# EasyEDA Pro project ProPrj_RPiPicoSoundBoard_2026-02-23.epro

# Schematic RPiPicoSoundBoard_SG
Board Name: Board1_SG; Create Date: 2026-02-08; Page Name: RPiPicoSoundBoard_SG; Project Name: RPiPicoSoundBoard; Schematic Name: RPiPicoSoundBoard_SG; Update Date: 2026-02-09; Page Size: A4; Version: V1.0
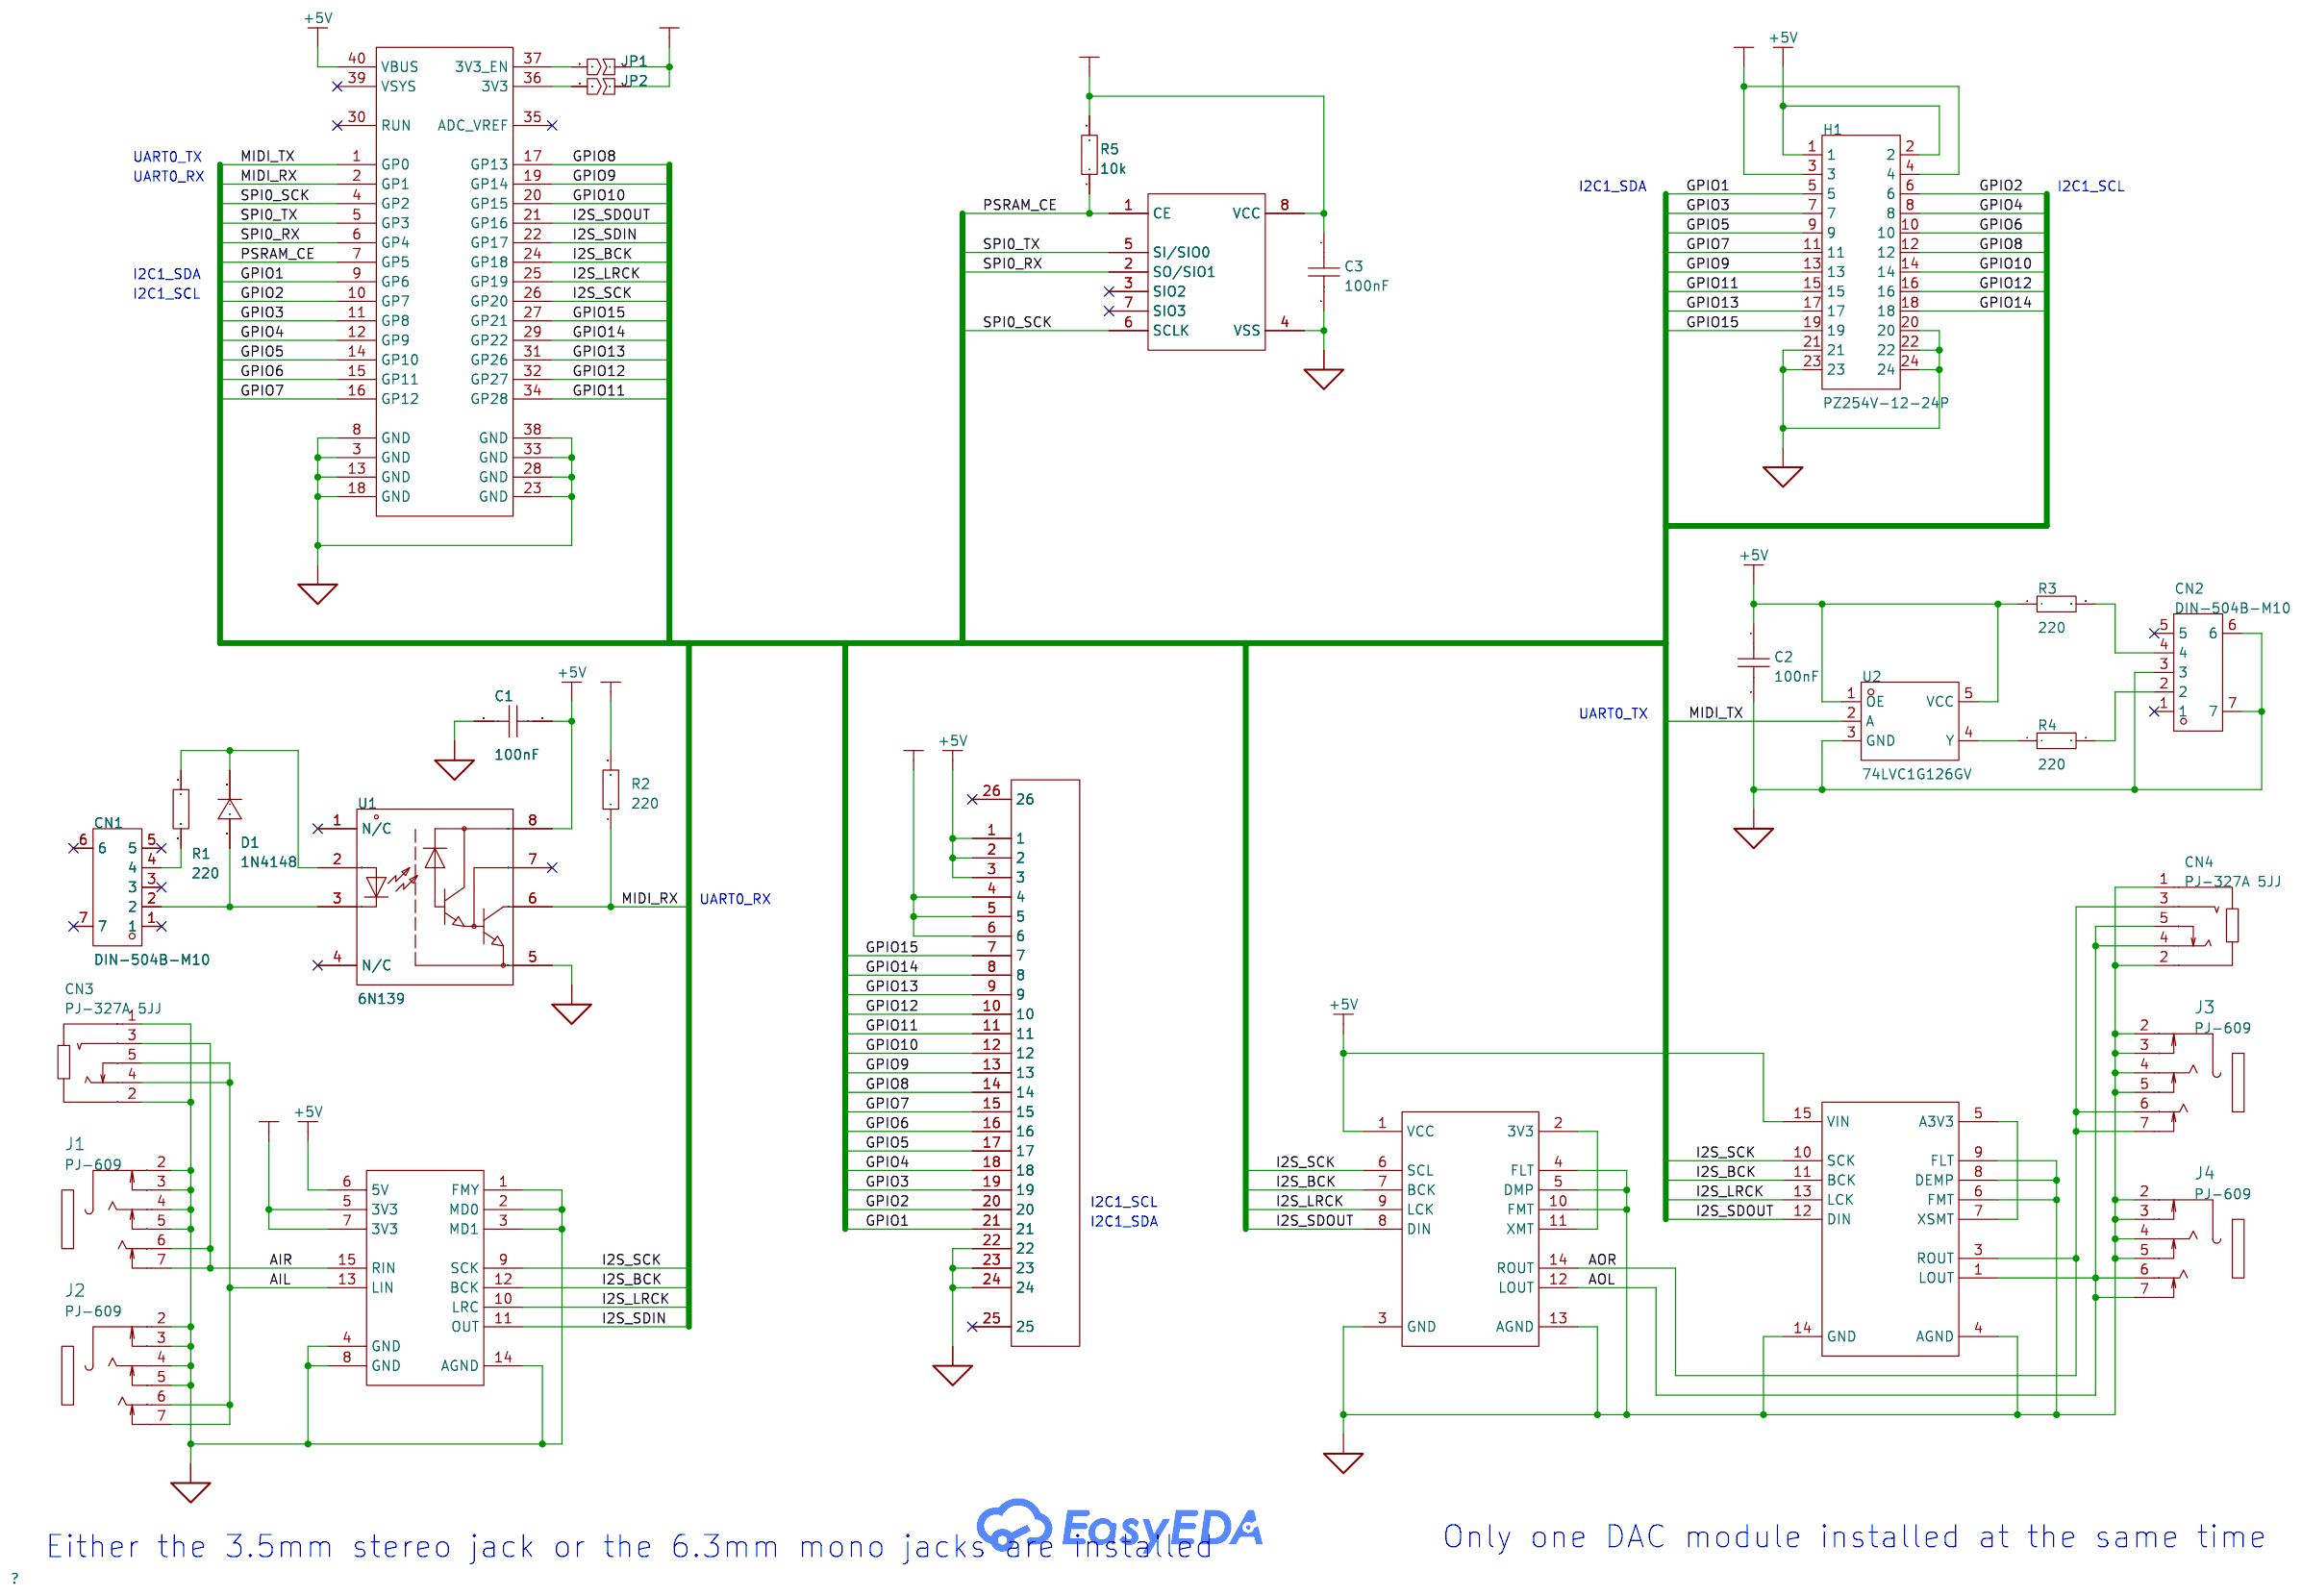
[diagram p0: schematic sheet]

## Parts
C1  100nF  [CAP-TH_L5.5-W2.4-P5.08-D0.6]
C2  100nF  [C0805]
C3  100nF  [C0805]
CN1  DIN-504B-M10  [CONN-TH_DIN-504B-M10]
CN2  DIN-504B-M10  [CONN-TH_DIN-504B-M10]
CN3  PJ-327A 5JJ  [AUDIO-SMD_PJ-327A5JJ]
CN4  PJ-327A 5JJ  [AUDIO-SMD_PJ-327A5JJ]
D1  1N4148  [DO-35_BD2.0-L4.0-P8.00-D0.5-FD]
FPC1  AFC01-S24FCA-00  [FPC-SMD_24P-P0.50_AFC01-S24FCA-00]
H1  PZ254V-12-24P  [HDR-TH_24P-P2.54-V-M-R2-C12-S2.54]
J1  PJ-609  [AUDIO-TH_PJ-609]
J2  PJ-609  [AUDIO-TH_PJ-609]
J3  PJ-609  [AUDIO-TH_PJ-609]
J4  PJ-609  [AUDIO-TH_PJ-609]
JP1  -  [Solder jumper]
JP2  -  [Solder jumper]
M1  Raspberry Pico  [Module_20x2_700mil]
M2  PCM1808  [PCM1808_ADC_MODULE]
M3  PCM5102  [WCMCU-5102]
M4  PCM5102  [PCM5102_MODULE]
R1  10kΩ  [R_AXIAL-0.4]
R2  10kΩ  [R_AXIAL-0.4]
R3  10kΩ  [R0805]
R4  10kΩ  [R0805]
R5  10kΩ  [R0805]
U1  6N139  [DIP-8_L9.6-W6.4-P2.54-LS7.9-BL]
U2  74LVC1G126GV  [SOT-753_L3.1-W1.7-P0.95-LS3.0-BR]
U3  PSRAM 8MB  [SOP-8_L5.3-W5.2-P1.27-LS7.9-BL]

## Library data of the parts
C1 = CC1H104ZC1FD3F5O1100: Capacitance: Tolerance:-20%~+80% Tolerance:-20%~+80% Voltage Rated: Lead Spacing: Temperature Coefficient: φD: Body Thickness:2.4mm; LCSC Part Name: 100nF -20%~+80% 50V; Supplier Part: C2832508; Manufacturer: Dersonic(德尔创); Supplier Footprint: 插件,P=5.08mm; JLCPCB Part Class: Extended Part; Datasheet: https://atta.szlcsc.com/upload/public/pdf/source/20211027/6BE094CC11F3C85D18CFEA066D7024CD.pdf; Supplier: LCSC; Tolerance: -20%~+80%; Body Thickness: 2.4mm
C2 C3 = CAP_0603: Supplier Footprint: 0603
CN1 CN2 = DIN-504B-M10: Supplier Part: C2939346; Manufacturer: HOOYA(皓宇电子); Supplier Footprint: 插件; JLCPCB Part Class: Extended Part; Datasheet: https://atta.szlcsc.com/upload/public/pdf/source/20220120/ABB2570656C6359DBC61E5C1017AC323.pdf; Supplier: LCSC
CN3 CN4 = PJ-327A 5JJ: Connector Type:3.5mm Headphone Jack Current Rating (Max):500mA Voltage Rating (Max):30V Contact Material:Copper Contact Plating:Gold Operating Temperature Range:-30℃~+70℃ Operating Temperature Range:-30℃~+70℃; LCSC Part Name: 3.5mm耳机座; Supplier Part: C668605; Manufacturer: SHOU HAN(首韩); Supplier Footprint: SMD; JLCPCB Part Class: Extended Part; Datasheet: https://atta.szlcsc.com/upload/public/pdf/source/20200618/C668605_9C1065207AFEF8C715B1238987CF5F80.pdf; Supplier: LCSC; Connector Type: 3.5mm Headphone Jack; Current Rating (Max): 500mA; Voltage Rating (Max): 30V; Contact Material: Copper; Contact Plating: Gold; Operating Temperature Range: -30℃~+70℃
D1 = 1N4148_C258182: Diode Configuration:- Voltage - Forward(Vf@If):1V@10mA Voltage - DC Reverse(Vr):100V Current - Rectified:200mA Reverse Leakage Current (Ir):5uA@75V Reverse Recovery Time (trr):4ns Operating Temperature:-55℃~+175℃@(Tj) Operating Temperature:-55℃~+175℃@(Tj); Supplier Part: C258182; Manufacturer: onsemi(安森美); Supplier Footprint: DO-35; JLCPCB Part Class: Extended Part; Datasheet: https://atta.szlcsc.com/upload/public/pdf/source/20180829/C258182_3EE2D0AB6109C1B72B054FC50B8BC8AD.pdf; Supplier: LCSC; Voltage - Forward(Vf@If): 1V@10mA; Voltage - DC Reverse(Vr): 100V; Current - Rectified: 200mA; Reverse Leakage Current (Ir): 5uA@75V; Reverse Recovery Time (trr): 4ns; Operating Temperature: -55℃~+175℃@(Tj)
FPC1 = PC_AFC01-S24FCA-00: Locking Feature:Flip type Contact Type:Bottom Contact Number of Contacts:24P Pitch:0.5mm Mounting Type:Horizontal attachment FFC, FCB Thickness:0.3mm FFC, FCB Thickness:0.3mm Height Above Board:2mm; LCSC Part Name: 间距:0.5mm P数:24P 翻盖式 下接; Supplier Part: C262669; Manufacturer: JS(钜硕电子); Supplier Footprint: SMD,P=0.5mm,卧贴; JLCPCB Part Class: Extended Part; Datasheet: https://atta.szlcsc.com/upload/public/pdf/source/20190816/C413942_2A72D1AC756EAE17EEDF756A339D4500.pdf; Supplier: LCSC; Locking Feature: Flip type; Contact Type: Bottom Contact; Number of Contacts: 24P; Pitch: 0.5mm; Mounting Type: Horizontal attachment; FFC, FCB Thickness: 0.3mm; Height Above Board: 2mm
H1 = PZ254V-12-24P: Pin Structure:2x12P Pitch:2.54mm Row Spacing:2.54mm Circluar Pins/Square Pins:Policy Mounting Type:Straight Number of Rows:Double Row Number of Pins:24P Current Rating:- Voltage Rating (Max):- Length of Mating Pin:6mm Insulation Height:2.5mm Length of End; LCSC Part Name: 2x12P 间距:2.54mm 方针 直插; Supplier Part: C492429; Manufacturer: XFCN(兴飞); Supplier Footprint: 插件,P=2.54mm; JLCPCB Part Class: Extended Part; Datasheet: https://atta.szlcsc.com/upload/public/pdf/source/20200309/C492429_A90DEF30FD4D9CDC2C3DDFC5EAF9C00B.pdf; Supplier: LCSC; Pin Structure: 2x12P; Pitch: 2.54mm; Row Spacing: 2.54mm; Circluar Pins/Square Pins: Policy; Mounting Type: Straight; Number of Rows: Double Row; Number of Pins: 24P; Length of Mating Pin: 6mm; Insulation Height: 2.5mm; Length of End Connection Pin: 3mm; Contact Material: Brass; Operating Temperature: -40℃~+105℃; Color: Black
J1-J4 = PJ-609: Connector Type:6.35mm耳机座 Current Rating (Max):1A Voltage Rating (Max):50V Operating Temperature Range:-20℃~+70℃ Operating Temperature Range:-20℃~+70℃; LCSC Part Name: 6.35mm耳机座 两件套; Supplier Part: C309274; Manufacturer: HOOYA(皓宇电子); Supplier Footprint: 插件; JLCPCB Part Class: Extended Part; Datasheet: https://atta.szlcsc.com/upload/public/pdf/source/20181226/C309274_AB77CFAA40746E22EC2996DC68F300B9.pdf; Supplier: LCSC; Connector Type: 6.35mm耳机座; Current Rating (Max): 1A; Voltage Rating (Max): 50V; Operating Temperature Range: -20℃~+70℃
JP1 JP2 = Solder jumper
M1 = RPI_Pico
M2 = PCM1808_ADC_Module: PCM1808 based ADC audio input module
M3 = WCMCU-5102: A PCM5102 based audio DAC module
M4 = PCM5102_Module: PCM5102 based audio DAC module
R1-R5 = Res_AXIAL-1/8W: Supplier Footprint: Through
U1 = 6N139_C5224104: Forward Voltage:1.4V Output Current:60mA Isolation Voltage(rms):5300V Number of Outputs:1 Operating Temperature:-55℃~+100℃ Operating Temperature:-55℃~+100℃; Supplier Part: C5224104; Manufacturer: VISHAY(威世); Supplier Footprint: DIP-8; JLCPCB Part Class: Extended Part; Datasheet: https://atta.szlcsc.com/upload/public/pdf/source/20221031/1E5B59C0BBF2E24895420015CB89D7D7.pdf; Supplier: LCSC; Forward Voltage: 1.4V; Output Current: 60mA; Isolation Voltage(rms): 5300V; Number of Outputs: 1; Operating Temperature: -55℃~+100℃
U2 = 74LVC1G126GV: Supplier Part: C703586; Manufacturer: Nexperia(安世); Supplier Footprint: SOT-753; JLCPCB Part Class: Extended Part; Datasheet: https://atta.szlcsc.com/upload/public/pdf/source/20200715/C703586_E6345225E39094214D3CD308CDCA878C.pdf; Supplier: LCSC
U3 = ESP_PSRAM64: 8MB of psuedo static random access memory with SPI in 8 pin small outline package

## Nets
3V3: C3.1 FPC1.4 FPC1.5 FPC1.6 H1.3 H1.4 JP1.1 JP2.1 M2.5(3V3) M2.7(3V3) R2.2 R5.2 U3.8(VCC)
+5V: C1.2 C2.1 FPC1.1 FPC1.2 FPC1.3 H1.1 H1.2 M1.40(VBUS) M2.6(5V) M3.1(VCC) M4.15(VIN) R3.1 U1.8(VCC) U2.1(OE) U2.5(VCC)
GND: C1.1 C2.2 C3.2 CN2.3 CN2.6 CN2.7 CN3.1 CN3.2 CN4.1 CN4.2 FPC1.22 FPC1.23 FPC1.24 H1.20 H1.21 H1.22 H1.23 H1.24 J1.2 J1.3 J1.4 J1.5 J2.2 J2.3 J2.4 J2.5 J3.2 J3.3 J3.4 J3.5 J4.2 J4.3 J4.4 J4.5 M1.3(GND) M1.8(GND) M1.13(GND) M1.18(GND) M1.23(GND) M1.28(GND) M1.33(GND) M1.38(GND) M2.1(FMY) M2.2(MD0) M2.3(MD1) M2.4(GND) M2.8(GND) M2.14(AGND) M3.3(GND) M3.4(FLT) M3.5(DMP) M3.10(FMT) M3.13(AGND) M4.4(AGND) M4.6(FMT) M4.8(DEMP) M4.9(FLT) M4.14(GND) U1.5(GND) U2.3(GND) U3.4(VSS)
AIL: CN3.4 CN3.5 J2.6 J2.7 M2.13(LIN)
AIR: CN3.3 J1.6 J1.7 M2.15(RIN)
AOL: CN4.4 CN4.5 J4.6 J4.7 M3.12(LOUT) M4.1(LOUT)
AOR: CN4.3 J3.6 J3.7 M3.14(ROUT) M4.3(ROUT)
GPIO1: FPC1.21 H1.5 M1.9(GP6)
GPIO2: FPC1.20 H1.6 M1.10(GP7)
GPIO3: FPC1.19 H1.7 M1.11(GP8)
GPIO4: FPC1.18 H1.8 M1.12(GP9)
GPIO5: FPC1.17 H1.9 M1.14(GP10)
GPIO6: FPC1.16 H1.10 M1.15(GP11)
GPIO7: FPC1.15 H1.11 M1.16(GP12)
GPIO8: FPC1.14 H1.12 M1.17(GP13)
GPIO9: FPC1.13 H1.13 M1.19(GP14)
GPIO10: FPC1.12 H1.14 M1.20(GP15)
GPIO11: FPC1.11 H1.15 M1.34(GP28)
GPIO12: FPC1.10 H1.16 M1.32(GP27)
GPIO13: FPC1.9 H1.17 M1.31(GP26)
GPIO14: FPC1.8 H1.18 M1.29(GP22)
GPIO15: FPC1.7 H1.19 M1.27(GP21)
I2S_BCK: M1.24(GP18) M2.12(BCK) M3.7(BCK) M4.11(BCK)
I2S_LRCK: M1.25(GP19) M2.10(LRC) M3.9(LCK) M4.13(LCK)
I2S_SCK: M1.26(GP20) M2.9(SCK) M3.6(SCL) M4.10(SCK)
I2S_SDIN: M1.22(GP17) M2.11(OUT)
I2S_SDOUT: M1.21(GP16) M3.8(DIN) M4.12(DIN)
MIDI_RX: M1.2(GP1) R2.1 U1.6(VO)
MIDI_TX: M1.1(GP0) U2.2(A)
PSRAM_CE: M1.7(GP5) R5.1 U3.1(CE)
SPI0_RX: M1.6(GP4) U3.2(SO/SIO1)
SPI0_SCK: M1.4(GP2) U3.6(SCLK)
SPI0_TX: M1.5(GP3) U3.5(SI/SIO0)
$1N8448: D1.2(K) R1.1 U1.2(VF+)
$1N8617: R4.1 U2.4(Y)
$1N9304: CN1.4 R1.2
$1N9313: CN1.2 D1.1(A) U1.3(VF-)
$1N9335: CN2.4 R3.2
$1N9340: CN2.2 R4.2
$1N10058: M3.2(3V3) M3.11(XMT)
$1N10064: M4.5(A3V3) M4.7(XSMT)
$1N32637: JP1.2 M1.37(3V3_EN)
$1N32663: JP2.2 M1.36(3V3)

Not connected (* = marked no-connect by the designer): CN1 1* 3* 5* 6* 7*; CN2 1* 5*; FPC1 25* 26*; M1 30(RUN)* 35(ADC_VREF)* 39(VSYS)*; U1 1(N/C)* 4(N/C)* 7(VB)*; U3 3(SIO2)* 7(SIO3)*

## Notes on the sheet
- UART0_TX
- UART0_RX
- I2C1_SDA
- I2C1_SCL
- I2C1_SDA
- I2C1_SCL
- UART0_TX
- UART0_RX
- I2C1_SCL
- I2C1_SDA
- Either the 3.5mm stereo jack or the 6.3mm mono jacks are installed
- Only one DAC module installed at the same time

# Board RPiPicoSoundBoard_SG
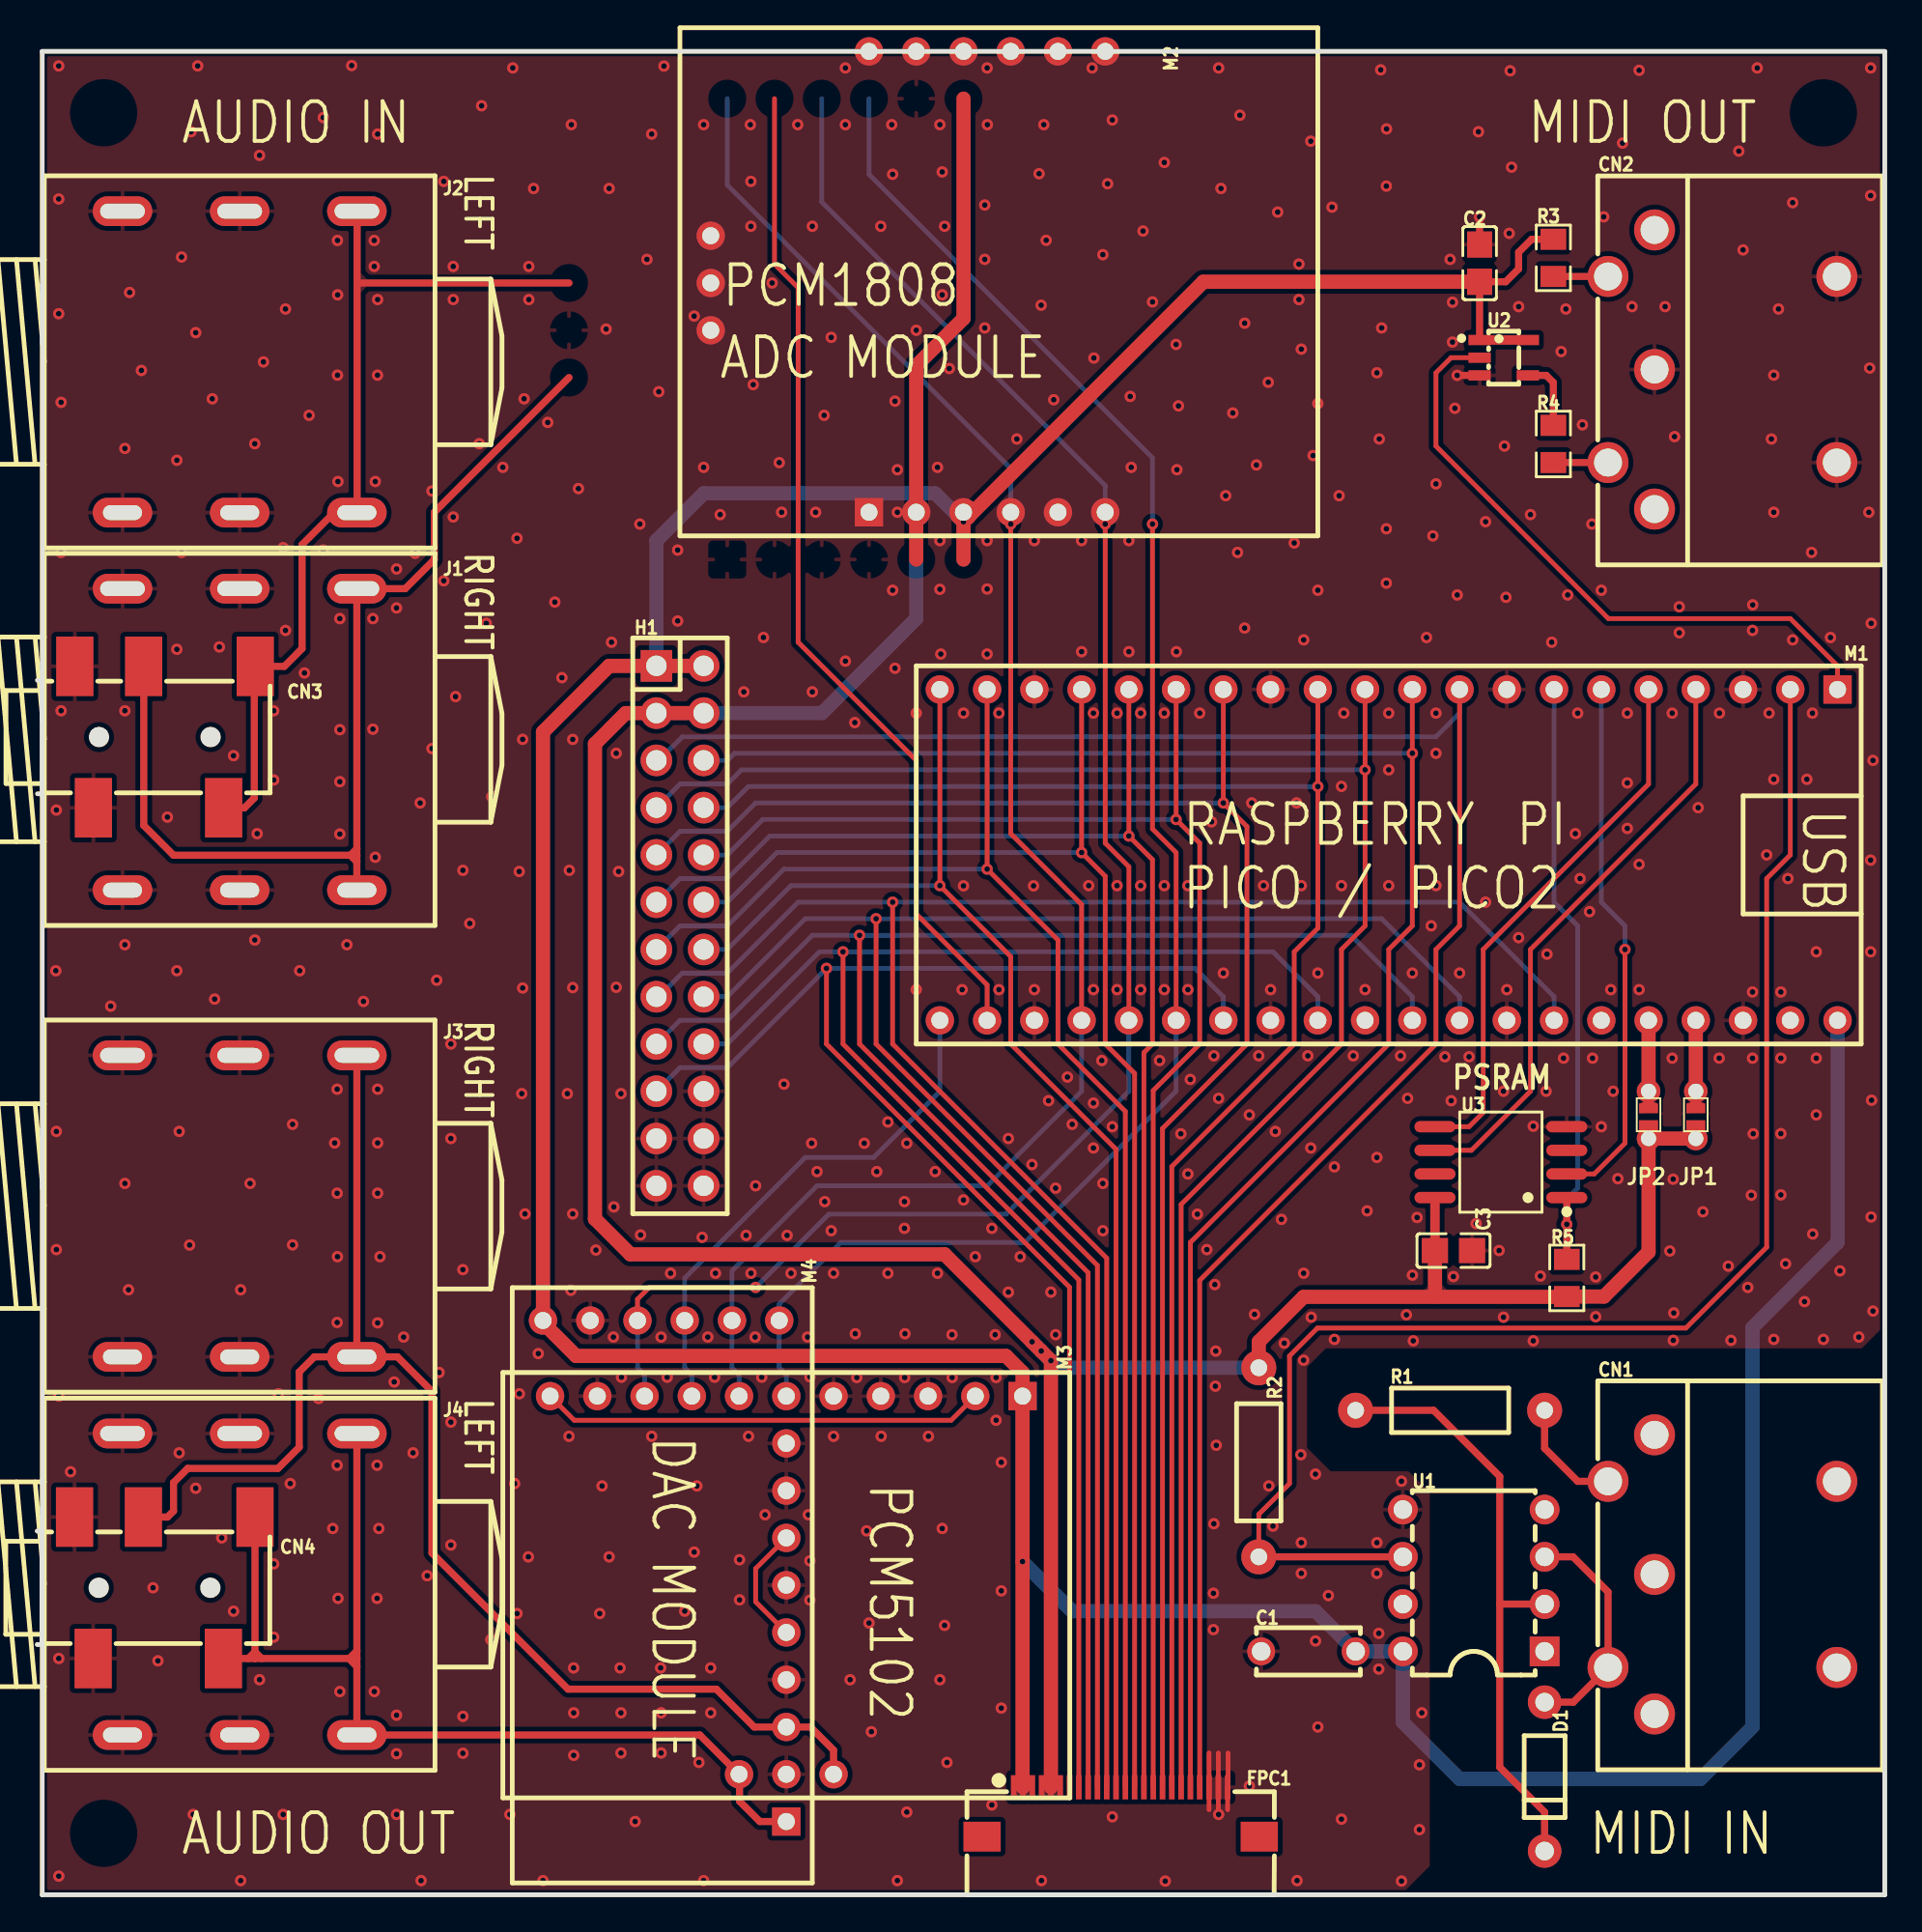
[diagram p1: board, top side]
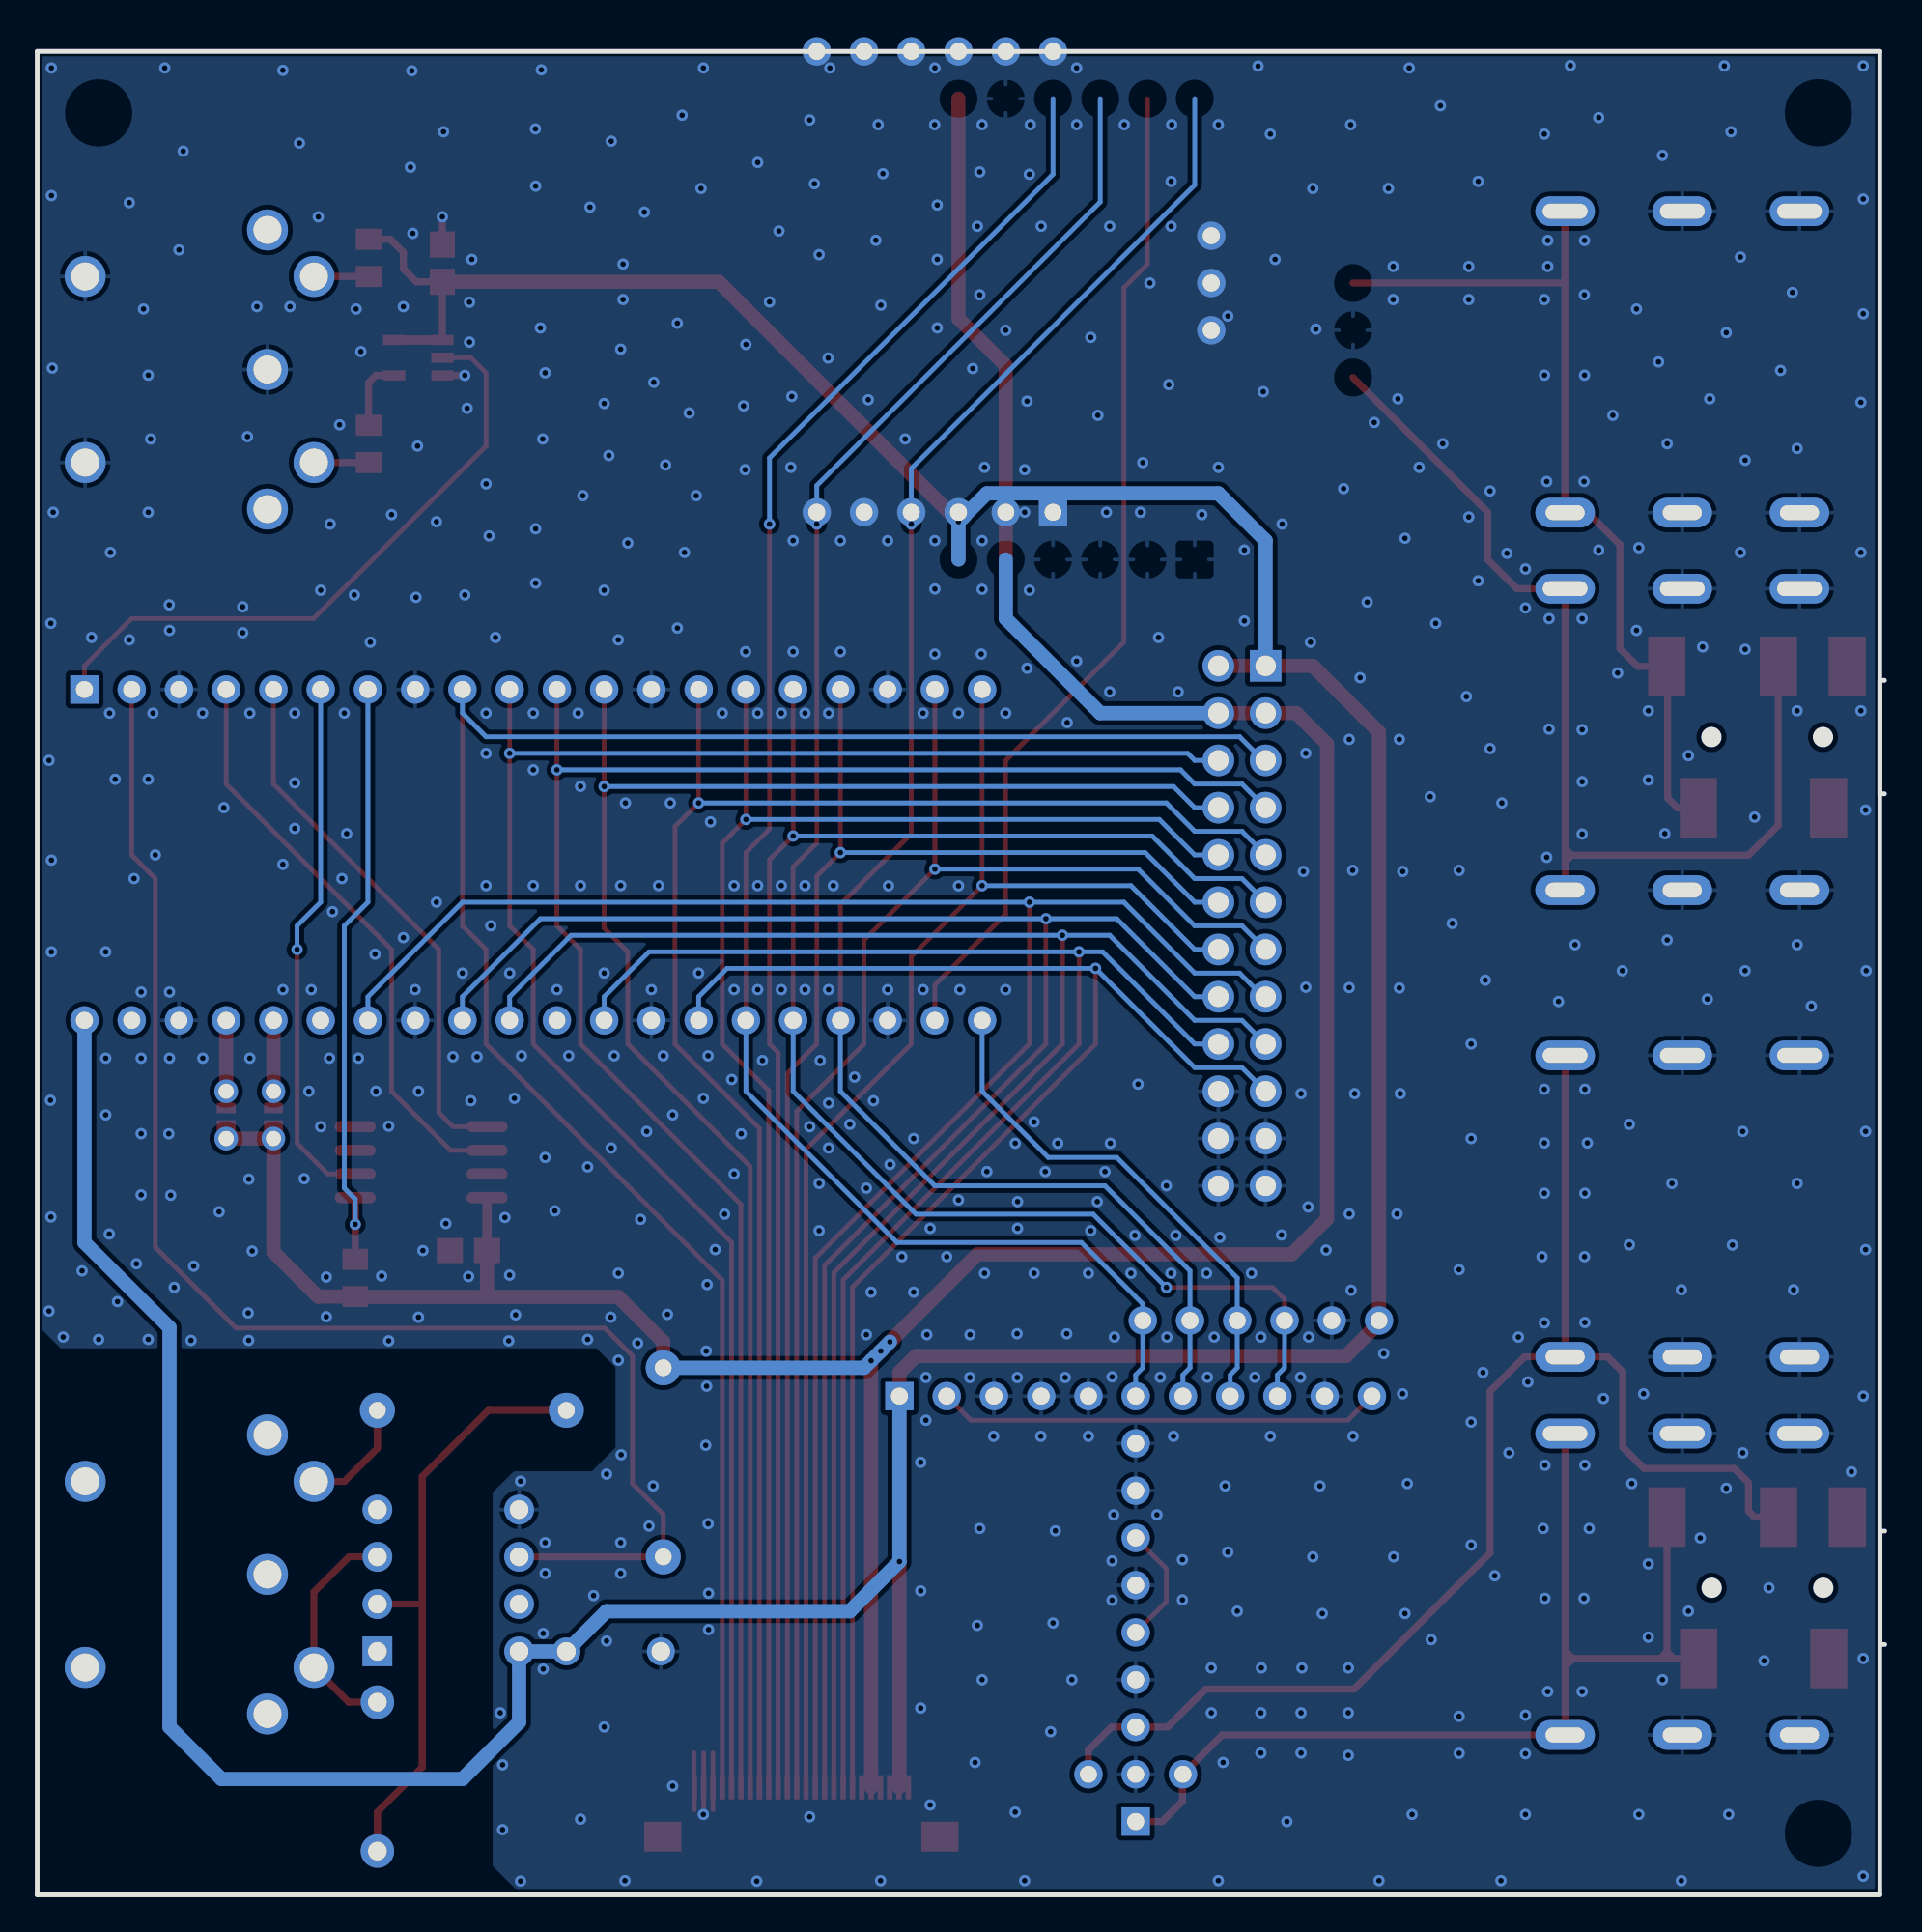
[diagram p2: board, bottom side, seen from below]

Outline 99.33 x 99.06 mm; copper layers: Top Layer, Bottom Layer. Coordinates in mm from the lower left corner of the outline.
Outline path: 0.27,99.06 99.33,99.06 99.33,0 0.27,0 0.27,99.06
Stack: Top Layer 0.035mm / Dielectric1 1.51mm FR4 er 4.5 / Bottom Layer 0.035mm

## Design rules (mm)
template: Custom Config
spacing copperThickness1oz (default): track to track 0.152, other pairs 0.152 to 0.3
spacing copperThickness2oz: track to track 0.203, other pairs 0.152 to 0.3
track width copperThickness1oz (default): min 0.127, default 0.254, max 2.54
track width copperThickness2oz: min 0.203, default 0.254, max 2.54
differential pair differentialPair (default): width min 0.127, default 0.254, max 2.54; gap min 0.152, default 0.152
via viaSize (default): diameter min 0.5, default 0.61, max 10; hole min 0.3, default 0.305, max 6.3

## Placement (name value [footprint] x y rotation side)
C1  100nF  [CAP-TH_L5.5-W2.4-P5.08-D0.6]  68.34 13.08 0 top
C2  100nF  [C0805]  77.54 87.68 90 top
C3  100nF  [C0805]  76.14 34.62 0 top
CN1  DIN-504B-M10  [CONN-TH_DIN-504B-M10]  90.6 17.22 90 top
CN2  DIN-504B-M10  [CONN-TH_DIN-504B-M10]  90.6 81.97 90 top
CN3  PJ-327A 5JJ  [AUDIO-SMD_PJ-327A5JJ]  6.87 62.22 90 top
CN4  PJ-327A 5JJ  [AUDIO-SMD_PJ-327A5JJ]  6.86 16.5 90 top
D1  1N4148  [DO-35_BD2.0-L4.0-P8.00-D0.5-FD]  81.04 6.35 270 top
FPC1  AFC01-S24FCA-00  [FPC-SMD_24P-P0.50_AFC01-S24FCA-00]  58.25 4.45 0 top
H1  PZ254V-12-24P  [HDR-TH_24P-P2.54-V-M-R2-C12-S2.54]  34.56 52.07 270 top
J1  PJ-609  [AUDIO-TH_PJ-609]  10.89 62.09 0 top
J2  PJ-609  [AUDIO-TH_PJ-609]  10.89 82.37 0 top
J3  PJ-609  [AUDIO-TH_PJ-609]  10.89 37.01 0 top
J4  PJ-609  [AUDIO-TH_PJ-609]  10.89 16.69 0 top
JP1  -  [Solder jumper]  89.17 41.37 90 top
JP2  -  [Solder jumper]  86.63 41.37 90 top
M1  Raspberry Pico  [Module_20x2_700mil]  96.79 64.77 270 top
M2  PCM1808  [PCM1808_ADC_MODULE]  37.1 71.75 90 top
M3  PCM5102  [WCMCU-5102]  52.97 26.8 270 top
M4  PCM5102  [PCM5102_MODULE]  40.27 3.94 180 top
NOREF  -  [Pad_e185]  86.63 43.18 0 top
NOREF#2  -  [Pad_e188]  86.63 40.64 0 top
NOREF#3  -  [Pad_e189]  89.17 40.64 0 top
NOREF#4  -  [Pad_e187]  89.17 43.18 0 top
R1  10kΩ  [R_AXIAL-0.4]  75.96 26.03 0 top
R2  10kΩ  [R_AXIAL-0.4]  65.67 23.24 90 top
R3  10kΩ  [R0805]  81.51 87.96 270 top
R4  10kΩ  [R0805]  81.51 77.96 270 top
R5  10kΩ  [R0805]  82.23 33.15 270 top
U1  6N139  [DIP-8_L9.6-W6.4-P2.54-LS7.9-BL]  77.23 16.89 90 top
U2  74LVC1G126GV  [SOT-753_L3.1-W1.7-P0.95-LS3.0-BR]  78.84 82.6 180 top
U3  PSRAM 8MB  [SOP-8_L5.3-W5.2-P1.27-LS7.9-BL]  78.69 39.37 90 top

## Footprints (pads in the part's own frame, mm; a bottom-side part is the same pattern mirrored in y, then rotated)
AUDIO-SMD_PJ-327A5JJ
  rect 3.2x2 smd: 1(3.8,4.85) 2(-3.8,3.85) 3(3.8,1.15) 4(-3.8,-3.15) 5(3.8,-4.85)
AUDIO-TH_PJ-609
  oval 3.2x1.6 hole 2.1x0.8: 2(-6.3,-8.1) 4(0,-8.1) 6(6.3,-8.1)
  oval 3.2x1.6 hole 2.4x0.8: 3(-6.3,8.1) 5(0,8.1) 7(6.3,8.1)
C0805
  rect 1.41x1.35 smd: 1(-1,0) 2(1,0)
CAP-TH_L5.5-W2.4-P5.08-D0.6
  round 1.5 hole 1: 1(-2.54,0) 2(2.54,0)
CONN-TH_DIN-504B-M10
  round 2.2 hole 1.5: 1(-7.5,3.65) 2(-5,6.15) 3(0,3.65) 4(5,6.15) 5(7.5,3.65) 6(-5,-6.15) 7(5,-6.15)
DIP-8_L9.6-W6.4-P2.54-LS7.9-BL
  rect 1.6x1.6 hole 1: 1(-3.81,-3.81)
  round 1.6 hole 1: 2(-1.27,-3.81) 3(1.27,-3.81) 4(3.81,-3.81) 5(3.81,3.81) 6(1.27,3.81) 7(-1.27,3.81) 8(-3.81,3.81)
DO-35_BD2.0-L4.0-P8.00-D0.5-FD
  round 1.8 hole 1: 1(-4,0) 2(4,0)
FPC-SMD_24P-P0.50_AFC01-S24FCA-00
  rect 0.3x1.3 smd: 1(-5.75,1.325) 2(-5.25,1.325) 3(-4.75,1.325) 4(-4.25,1.325) 5(-3.75,1.325) 6(-3.25,1.325) 7(-2.75,1.325) 8(-2.25,1.325) 9(-1.75,1.325) 10(-1.25,1.325) 11(-0.75,1.325) 12(-0.25,1.325) 13(0.25,1.325) 14(0.75,1.325) 15(1.25,1.325) 16(1.75,1.325) 17(2.25,1.325) 18(2.75,1.325) 19(3.25,1.325) 20(3.75,1.325) 21(4.25,1.325) 22(4.75,1.325) 23(5.25,1.325) 24(5.75,1.325)
  rect 2x1.6 smd: 25(7.45,-1.325) 26(-7.45,-1.325)
HDR-TH_24P-P2.54-V-M-R2-C12-S2.54
  rect 1.7x1.7 hole 1.1: 1(-13.97,-1.27)
  round 1.7 hole 1.1: 2(-13.97,1.27) 3(-11.43,-1.27) 4(-11.43,1.27) 5(-8.89,-1.27) 6(-8.89,1.27) 7(-6.35,-1.27) 8(-6.35,1.27) 9(-3.81,-1.27) 10(-3.81,1.27) 11(-1.27,-1.27) 12(-1.27,1.27) 13(1.27,-1.27) 14(1.27,1.27) 15(3.81,-1.27) 16(3.81,1.27) 17(6.35,-1.27) 18(6.35,1.27) 19(8.89,-1.27) 20(8.89,1.27) 21(11.43,-1.27) 22(11.43,1.27) 23(13.97,-1.27) 24(13.97,1.27)
Module_20x2_700mil
  rect 1.524x1.524 hole 0.914: 1(0,0)
  round 1.524 hole 0.914: 2(0,-2.54) 3(0,-5.08) 4(0,-7.62) 5(0,-10.16) 6(0,-12.7) 7(0,-15.24) 8(0,-17.78) 9(0,-20.32) 10(0,-22.86) 11(0,-25.4) 12(0,-27.94) 13(0,-30.48) 14(0,-33.02) 15(0,-35.56) 16(0,-38.1) 17(0,-40.64) 18(0,-43.18) 19(0,-45.72) 20(0,-48.26) 21(17.78,-48.26) 22(17.78,-45.72) 23(17.78,-43.18) 24(17.78,-40.64) 25(17.78,-38.1) 26(17.78,-35.56) 27(17.78,-33.02) 28(17.78,-30.48) 29(17.78,-27.94) 30(17.78,-25.4) 31(17.78,-22.86) 32(17.78,-20.32) 33(17.78,-17.78) 34(17.78,-15.24) 35(17.78,-12.7) 36(17.78,-10.16) 37(17.78,-7.62) 38(17.78,-5.08) 39(17.78,-2.54) 40(17.78,0)
Pad_e185
  round 1.27 hole 0.813: 1(0,0)
Pad_e187
  round 1.27 hole 0.813: 1(0,0)
Pad_e188
  round 1.27 hole 0.813: 1(0,0)
Pad_e189
  round 1.27 hole 0.813: 1(0,0)
PCM1808_ADC_MODULE
  rect 1.524x1.524 hole 0.914: 1(2.54,-7.62)
  round 1.524 hole 0.914: 2(2.54,-10.16) 3(2.54,-12.7) 4(2.54,-15.24) 5(2.54,-17.78) 6(2.54,-20.32) 7(27.305,-20.32) 8(27.305,-17.78) 9(27.305,-15.24) 10(27.305,-12.7) 11(27.305,-10.16) 12(27.305,-7.62) 13(17.399,0.889) 14(14.859,0.889) 15(12.319,0.889)
PCM5102_MODULE
  rect 1.524x1.524 hole 0.914: 1(0,0)
  round 1.524 hole 0.914: 3(0,-5.08) 4(0,-7.62) 5(0,-10.16) 6(0,-12.7) 7(0,-15.24) 8(0,-17.78) 9(0,-20.32) 10(0.381,-26.924) 11(2.921,-26.924) 12(5.461,-26.924) 13(8.001,-26.924) 14(10.541,-26.924) 15(13.081,-26.924)
R0805
  rect 1.133x1.377 smd: 1(-1,0) 2(1,0)
R_AXIAL-0.4
  round 1.879 hole 0.899: 1(-5.08,0) 2(5.08,0)
Solder jumper
  custom 0.635x1.016 smd: 1(0.021,0)
  custom 0.692x1.016 smd: 2(0.973,0)
SOP-8_L5.3-W5.2-P1.27-LS7.9-BL
  oval 0.609x2.204 smd: 1(-1.905,-3.542) 2(-0.635,-3.542) 3(0.635,-3.542) 4(1.905,-3.542) 5(1.905,3.542) 6(0.635,3.542) 7(-0.635,3.542) 8(-1.905,3.542)
SOT-753_L3.1-W1.7-P0.95-LS3.0-BR
  rect 1.199x0.551 smd: 1(1.296,-0.95) 2(1.296,0) 3(1.296,0.95) 4(-1.296,0.95) 5(-1.296,-0.95)
WCMCU-5102
  rect 1.524x1.524 hole 0.914: 1(0,0)
  round 1.524 hole 0.914: 2(0,-2.54) 3(0,-5.08) 4(0,-7.62) 5(0,-10.16) 6(0,-12.7) 7(0,-15.24) 8(0,-17.78) 9(0,-20.32) 10(0,-22.86) 11(0,-25.4) 12(20.32,-15.24) 13(20.32,-12.7) 14(20.32,-10.16)

## Nets
As in the schematic, except:
3V3: C3.1 FPC1.4 FPC1.5 FPC1.6 H1.3 H1.4 JP1.1 JP2.1 M2.5 M2.7 NOREF#2.1 NOREF#3.1 R2.2 R5.2 U3.8
$1N32637: JP1.2 M1.37 NOREF#4.1
$1N32663: JP2.2 M1.36 NOREF.1

Pads without a net: CN1 1 3 5 6 7; CN2 1 5; FPC1 25 26; M1 30 35 39; U1 1 4 7; U3 3 7

## Via types
v1: diameter 0.61, hole 0.305, Top Layer to Bottom Layer, 663 vias

## Routing (per net, layer and track width the routed paths; a pad name or vN(x,y) marks a point on that pad's centre or on a via; arc(x,y) is an arc through that point)
3V3: length 176.2
  Top Layer w0.508: C3.1 75.15,34.62 U3.8
  Top Layer w0.762: 47.26,71.75 47.26,82.17 49.8,84.71 49.8,96.52 ; 75.15,32.16 75.15,34.62 C3.1 ; 54.5,5.78 v1(54.5,28.7) v1(53.98,29.22) v1(53.48,29.72) 48.78,34.42 31.89,34.42 29.99,36.32 29.99,61.85 31.64,63.5 H1.3 H1.4 ; 65.67,28.32 65.67,29.72 68.09,32.13 82.21,32.13 R5.2 84.23,32.15 86.63,34.54 NOREF#2.1 NOREF#3.1
  Bottom Layer w0.762: H1.4 42.18,63.5 47.26,68.58 47.26,71.75 ; 65.67,28.32 54.88,28.32 v1(54.5,28.7) v1(53.98,29.22) 53.48,29.72
+5V: length 260.5
  Top Layer w0.381: R3.1 80.34,88.96 79.64,88.27 79.64,87.38 78.95,86.68 C2.1 77.54,83.55
  Top Layer w0.508: U2.1 U2.5
  Top Layer w0.762: H1.2 H1.1 30.75,66.04 27.19,62.48 27.19,30.73 28.97,28.96 52.08,28.96 52.97,28.07 M3.1 v1(52.97,17.91) 52.97,5.8 FPC1.2 ; C2.1 62.69,86.68 v1(49.8,73.79) 49.8,71.75
  Bottom Layer w0.762: 49.8,71.76 49.8,73.79 48.27,75.31 35.83,75.31 33.29,72.77 H1.1 ; M3.1 v1(52.97,17.91) 55.64,15.24 68.72,15.24 C1.2 U1.8 73.42,9.27 76.47,6.22 89.42,6.22 92.22,9.02 92.22,30.48 96.79,35.05 M1.40
GND: length 11.8
  Top Layer w0.254: 63.5,7.62 FPC1.23 63.5,4.59 ; 63,7.62 FPC1.22 63,4.57 ; 64,4.57 FPC1.24 64.02,5.8 64.02,7.62
  Top Layer w0.381: C2.2 v1(77.54,90.17) ; U2.3 v1(76.34,81.65)
  vias: v1(1,49.66) v1(1.03,58.29) v1(1.03,41.02) v1(1.03,34.67) v1(1.16,98.28) v1(1.16,91.13) v1(1.16,84.96) v1(1.16,26.8) v1(1.16,12.7) v1(1.16,1) v1(1.28,80.2) v1(1.28,72.14) v1(1.28,63.63) v1(1.79,22.73) v1(3.95,47.75) v1(4.71,77.72) v1(4.71,63.63) v1(4.71,51.05) v1(4.71,38.23) v1(4.91,32.51) v1(4.97,86.11) v1(5.6,81.92) v1(6.23,16.5) v1(6.49,12.57) v1(7,57.91) v1(7.51,77.09) v1(7.51,66.93) v1(7.51,49.66) v1(7.63,41.02) v1(7.63,23.75) v1(7.76,88.01) v1(7.76,72.14) v1(8.19,34.92) v1(8.27,94.74) v1(8.39,4.32) v1(8.52,83.95) v1(8.52,21.84) v1(8.63,98.28) v1(9.41,80.39) v1(9.54,48.13) v1(9.79,67.06) v1(9.92,19.18) v1(10.56,61.21) v1(10.56,15.24) v1(10.94,32.51) v1(10.94,0.76) v1(11.44,38.23) v1(11.7,77.98) v1(11.7,51.31) v1(11.83,57.02) v1(11.95,93.47) v1(11.95,11.56) v1(12.16,82.37) v1(12.71,63.63) v1(12.71,59.91) v1(12.71,17.78) v1(12.71,13.84) v1(12.97,26.92) v1(13.22,72.39) v1(13.22,4.32) v1(13.35,85.22) v1(13.35,67.95) v1(13.6,22.1) v1(13.73,41.4) v1(13.73,34.92) v1(14.11,49.66) v1(14.36,65.66) v1(14.62,79.5) v1(15.13,26.67) v1(15.38,95.5) v1(15.38,72.26) v1(15.89,19.69) v1(15.99,40.4) v1(16.14,88.9) v1(16.15,85.98) v1(16.14,81.66) v1(16.17,75.95) v1(16.12,43.29) v1(16.12,37.7) v1(16.14,34.29) v1(16.12,30.75) v1(16.12,23.08) v1(16.17,15.93) v1(16.27,68.58) v1(16.27,62.61) v1(16.27,59.82) v1(16.27,57) v1(16.27,10.92) v1(16.65,51.05) v1(16.91,98.3) v1(17.54,48.01) v1(18.05,68.58) v1(18.05,62.64) v1(18.12,88.9) v1(18.12,87.5) v1(18.17,75.95) v1(18.17,55.75) v1(18.12,10.92) v1(18.3,94.62) v1(18.3,85.73) v1(18.3,81.66) v1(18.3,43.29) v1(18.3,40.4) v1(18.3,37.7) v1(18.3,30.73) v1(18.27,23.08) v1(18.27,15.93) v1(18.37,19.69) v1(18.43,34.29) v1(19.19,27.56) v1(19.32,71.25) v1(19.32,69.15) v1(19.32,9.65) v1(19.32,7.58) v1(19.32,4.32) v1(19.7,29.97) v1(20.21,23.75) v1(20.32,72.09) v1(20.59,58.67) v1(20.64,0.76) v1(20.97,17.15) v1(21.22,75.44) v1(21.22,61.59) v1(21.48,49.15) v1(21.6,28.07) v1(21.86,92.08) v1(21.86,70.61) v1(22.24,45.72) v1(22.24,40.64) v1(22.24,25.4) v1(22.24,18.8) v1(22.37,87.5) v1(22.37,85.73) v1(22.37,74.04) v1(22.49,64.39) v1(22.89,55.05) v1(22.89,33.59) v1(22.89,9.59) v1(22.89,7.6) v1(23.25,52.2) v1(23.76,77.98) v1(23.89,96.14) v1(24.14,68.33) v1(24.39,13.71) v1(24.44,59.01) v1(25.03,76.71) v1(25.41,4.32) v1(25.57,98.17) v1(25.67,22.1) v1(25.8,72.9) v1(25.8,15.11) v1(25.91,54.99) v1(25.92,26.92) v1(26.1,62.09) v1(26.1,48.73) v1(26.05,43.05) v1(26.18,80.39) v1(26.22,36.59) v1(26.4,18.16) v1(26.43,87.5) v1(26.43,85.73) v1(26.68,91.69) v1(26.94,29.08) v1(27.19,0.76) v1(27.45,79.12) v1(27.83,69.47) v1(28.21,65.41) v1(28.5,43.05) v1(28.61,55.05) v1(28.59,24.64) v1(28.72,95.12) v1(28.69,32.49) v1(28.79,62.09) v1(28.79,48.75) v1(28.79,36.59) v1(28.84,12.19) v1(28.84,9.78) v1(28.84,7.49) v1(29.1,75.56) v1(30.04,34.65) v1(30.24,15.11) v1(30.37,21.97) v1(30.59,84.14) v1(30.75,91.69) v1(30.75,18.16) v1(30.88,67.31) v1(31,36.97) v1(30.98,29.97) v1(31.13,61.34) v1(31.13,48.77) v1(31.26,54.99) v1(31.38,43.05) v1(31.41,27.81) v1(31.34,12.19) v1(31.38,9.78) v1(31.38,7.62) v1(32.15,3.94) v1(32.4,73.66) v1(32.44,35.46) v1(32.78,87.88) v1(33.03,94.62) v1(33.03,24.64) v1(33.41,80.77) v1(33.52,12.19) v1(33.54,29.97) v1(33.54,9.78) v1(33.54,7.62) v1(33.69,98.27) v1(33.87,27.81) v1(34.05,33.4) v1(34.43,72.26) v1(34.43,68.45) v1(34.81,15.24) v1(35.32,84.84) v1(35.32,18.41) v1(35.47,21.97) v1(35.57,7.11) v1(35.75,35.33) v1(35.83,95.12) v1(35.83,76.71) v1(35.83,0.76) v1(36.05,29.97) v1(36.21,12.19) v1(36.21,9.78) v1(36.42,27.81) v1(36.46,33.4) v1(36.72,74.17) v1(37.76,18.01) v1(37.76,15.85) v1(37.99,64.64) v1(38.11,35.43) v1(38.24,24.64) v1(38.34,95.12) v1(38.37,92.08) v1(38.37,89.66) v1(38.38,33.4) v1(38.5,81.15) v1(38.6,29.97) v1(38.62,38.1) v1(38.95,27.81) v1(39.04,67.56) v1(39.13,20.42) v1(39.51,86.61) v1(39.89,76.96) v1(40.02,74.3) v1(40.15,43.56) v1(40.31,35.43) v1(40.53,33.4) v1(40.89,95.12) v1(41.42,29.97) v1(41.46,20.42) v1(41.54,27.83) v1(41.54,17.95) v1(41.54,15.83) v1(41.67,89.66) v1(41.67,64.64) v1(41.63,40.39) v1(41.85,74.3) v1(41.92,38.86) v1(42.31,79.5) v1(42.34,37.25) v1(42.69,83.69) v1(42.69,35.69) v1(42.81,33.4) v1(42.81,24.64) v1(43.45,98.17) v1(43.45,95.12) v1(43.45,66.29) v1(43.7,11.56) v1(43.96,62.99) v1(43.98,30.15) v1(44.06,27.8) v1(44.46,40.39) v1(44.59,19.56) v1(44.72,14.6) v1(44.84,8.76) v1(45.13,38.86) v1(45.35,89.66) v1(45.37,24.64) v1(45.73,41.53) v1(45.73,33.4) v1(45.94,95.12) v1(45.99,92.46) v1(45.99,70.1) v1(46.12,80.26) v1(46.12,65.91) v1(46.24,76.58) v1(46.24,74.3) v1(46.24,0.76) v1(46.62,37.25) v1(46.62,35.81) v1(46.65,30.15) v1(46.64,27.8) v1(46.75,40.39) v1(46.75,4.44) v1(47.26,84.07) v1(47.26,63.5) v1(47.26,48.64) v1(47.91,24.64) v1(48.27,38.86) v1(48.4,76.71) v1(48.4,33.4) v1(48.53,95.12) v1(48.53,72.77) v1(48.53,70.15) v1(48.58,66.67) v1(48.53,11.56) v1(48.66,92.58) v1(48.66,85.98) v1(48.66,19.69) v1(48.78,89.66) v1(48.78,14.48) v1(48.91,7.11) v1(49.04,82.02) v1(49.18,30.1) v1(49.19,27.8) v1(49.8,63.5) v1(49.8,54.22) v1(49.72,48.64) v1(49.8,37.34) v1(50.43,34.29) v1(50.94,90.81) v1(50.94,87.88) v1(50.94,84.2) v1(51.07,98.17) v1(51.08,95.12) v1(51.07,72.77) v1(51.07,70.17) v1(51.07,66.67) v1(51.32,35.81) v1(51.32,4.83) v1(51.5,30.1) v1(51.55,27.8) v1(51.55,25.5) v1(51.7,63.5) v1(51.7,48.64) v1(51.83,23.24) v1(51.83,16.33) v1(51.83,10.03) v1(52.21,40.64) v1(52.21,32.39) v1(52.67,78.23) v1(52.85,34.29) v1(53.48,39.24) v1(53.61,72.77) v1(53.56,54.22) v1(53.61,48.64) v1(53.86,92.49) v1(53.97,85.42) v1(53.99,0.76) v1(54.12,95.12) v1(54.24,88.91) v1(54.37,42.67) v1(54.5,32.39) v1(54.65,80.34) v1(54.75,37.97) v1(54.75,30.1) v1(55.39,43.94) v1(55.64,41.4) v1(56.15,72.77) v1(56.15,66.8) v1(56.53,54.23) v1(56.71,98.17) v1(56.81,82.58) v1(56.78,63.5) v1(56.78,48.64) v1(56.78,42.55) v1(56.78,40.13) v1(57.29,88.14) v1(57.23,44.83) v1(57.29,38.23) v1(57.29,35.69) v1(57.54,91.95) v1(57.8,95.38) v1(57.8,41.28) v1(57.8,4.19) v1(58.05,63.5) v1(58.05,54.23) v1(58.05,48.64) v1(58.69,72.77) v1(58.69,66.8) v1(58.76,80.52) v1(58.81,76.71) v1(59.32,63.5) v1(59.32,54.23) v1(59.32,48.64) v1(59.45,89.41) v1(59.96,85.6) v1(60.34,44.83) v1(60.59,93.09) v1(60.59,63.5) v1(60.59,54.23) v1(60.59,48.64) v1(60.64,0.74) v1(61.23,83.31) v1(61.27,76.58) v1(61.25,66.8) v1(61.35,80.01) v1(61.48,40.89) v1(61.86,54.23) v1(61.86,48.64) v1(61.86,38.73) v1(61.99,43.81) v1(62.37,36.58) v1(62.5,63.5) v1(62.88,34.67) v1(63.13,57.66) v1(63.26,45.09) v1(63.31,32.79) v1(63.26,19.94) v1(63.23,16.21) v1(63.23,14.25) v1(63.36,29.22) v1(63.34,27.33) v1(63.39,24.16) v1(63.51,98.17) v1(63.51,42.8) v1(63.51,4.32) v1(63.64,91.69) v1(63.77,49.53) v1(63.9,75.18) v1(64.28,79.63) v1(64.53,72.14) v1(64.66,95.63) v1(64.92,84.45) v1(64.91,68.07) v1(65.16,41.91) v1(65.16,5.84) v1(65.29,58.67) v1(65.44,31.19) v1(65.55,76.84) v1(65.67,45.09) v1(65.93,54.23) v1(66.18,81.28) v1(66.21,21.97) v1(66.31,48.64) v1(66.44,19.81) v1(66.56,41.02) v1(66.69,90.42) v1(66.89,36.3) v1(67.04,29.64) v1(67.58,72.64) v1(67.71,58.67) v1(67.73,0.76) v1(67.83,87.63) v1(67.83,85.73) v1(67.96,83.06) v1(67.96,54.23) v1(67.94,23.65) v1(67.96,18.92) v1(67.96,17.27) v1(68.09,67.44) v1(68.09,33.4) v1(68.08,28.73) v1(68.31,45.09) v1(68.47,94.23) v1(68.47,40.13) v1(68.49,31.04) v1(68.59,77.34) v1(68.72,22.61) v1(68.72,13.64) v1(68.85,80.14) v1(68.85,70.1) v1(68.85,49.53) v1(68.85,9.02) v1(69.42,16.08) v1(69.61,90.69) v1(69.74,39.12) v1(69.74,29.84) v1(69.99,75.18) v1(70.12,59.56) v1(70.12,54.23) v1(70.12,4.06) v1(70.25,63.5) v1(70.75,45.09) v1(71.39,48.64) v1(71.5,36.75) v1(72.02,81.79) v1(72.02,39.62) v1(72.02,18.92) v1(72.02,17.27) v1(72.15,78.23) v1(72.12,14.05) v1(72.12,12.13) v1(72.23,98.07) v1(72.28,84.2) v1(72.54,94.9) v1(72.53,91.82) v1(72.53,73.41) v1(72.53,70.48) v1(72.66,63.5) v1(72.66,60.45) v1(72.66,54.23) v1(73.29,45.09) v1(73.34,22.22) v1(73.34,0.74) v1(73.61,31.17) v1(73.67,42.8) v1(73.93,49.53) v1(73.93,33.3) v1(73.98,29.77) v1(74.18,36.4) v1(74.31,6.99) v1(74.31,3.5) v1(74.44,9.78) v1(74.69,67.56) v1(74.94,52.07) v1(75.03,73.03) v1(75.2,75.82) v1(75.2,63.5) v1(75.2,61.34) v1(75.2,54.23) v1(75.68,45.03) v1(75.96,87.88) v1(76.02,42.67) v1(76.09,85.58) v1(76.09,83.44) v1(76.21,79.88) v1(76.14,33.22) v1(76.34,69.85) v1(76.47,49.53) v1(76.98,45.03) v1(77.36,36.07) v1(77.48,94.74) v1(77.87,73.79) v1(77.87,53.34) v1(78.59,34.62) v1(78.88,77.85) v1(78.83,43.18) v1(78.83,31.04) v1(78.96,69.72) v1(79.01,48.64) v1(79.19,98.02) v1(79.13,89.28) v1(79.26,92.84) v1(79.64,85.34) v1(79.64,51.44) v1(80.28,74.17) v1(80.43,41.3) v1(80.43,29.77) v1(80.81,33.25) v1(81.12,43.18) v1(81.17,50.55) v1(81.42,67.31) v1(81.93,82.93) v1(82.06,44.96) v1(82.18,85.22) v1(82.28,69.85) v1(82.69,57.02) v1(82.82,63.5) v1(82.94,54.61) v1(83.07,78.99) v1(83.45,52.83) v1(83.58,73.66) v1(83.62,44.96) v1(83.78,33.2) v1(83.78,31.06) v1(84.09,70.1) v1(84.09,41.28) v1(84.22,90.17) v1(84.59,48.64) v1(84.72,43.18) v1(84.98,38.48) v1(85.23,94.13) v1(85.49,63.5) v1(85.49,59.75) v1(85.49,57.31) v1(85.74,85.34) v1(86.12,98.04) v1(86.12,55.37) v1(86.12,48.64) v1(87.52,85.34) v1(87.77,34.59) v1(87.9,63.5) v1(87.9,44.96) v1(87.95,38.46) v1(87.98,31.27) v1(87.96,29.79) v1(88.03,78.36) v1(88.28,69.22) v1(88.28,67.82) v1(89.29,58.42) v1(89.55,36.7) v1(90.44,63.5) v1(90.43,44.96) v1(90.91,33.78) v1(91.06,29.79) v1(91.48,93.7) v1(91.71,88.39) v1(91.96,32.64) v1(92.22,67.95) v1(92.22,48.51) v1(92.22,44.96) v1(92.15,37.59) v1(92.23,69.32) v1(92.25,40.89) v1(92.47,98.17) v1(92.98,55.88) v1(93.1,63.5) v1(93.23,78.23) v1(93.36,81.66) v1(93.36,74.3) v1(93.36,59.94) v1(93.36,29.84) v1(93.61,85.22) v1(93.74,48.51) v1(93.74,44.96) v1(93.74,40.9) v1(93.74,37.61) v1(93.99,33.91) v1(94.12,54.61) v1(94.38,90.93) v1(94.38,67.44) v1(95.01,31.88) v1(95.14,59.94) v1(95.39,72.14) v1(95.44,63.5) v1(95.45,35.51) v1(95.65,50.67) v1(95.65,44.96) v1(95.65,41.91) v1(96.03,29.84) v1(96.41,67.56) v1(96.91,33.53) v1(97.93,29.97) v1(98.52,82.04) v1(98.47,74.3) v1(98.57,98.17) v1(98.57,91.31) v1(98.6,68.33) v1(98.57,55.6) v1(98.57,50.67) v1(98.62,42.7) v1(98.59,36.42) v1(98.69,60.96) v1(98.69,31.37)
AIL: length 49.6
  Top Layer w0.381: 17.2,90.47 17.2,86.61 ; 17.2,86.61 28.59,86.61 ; 17.2,86.61 17.2,74.27 ; 17.96,74.27 17.2,74.27 ; 17.2,74.27 15.96,74.27 14.24,72.55 14.24,66.97 13.29,66.02 11.67,66.02 11.67,58.94 11.14,58.41 9.98,58.41 9.97,58.42
AIR: length 55.5
  Top Layer w0.381: 28.59,81.53 21.35,74.3 21.35,71.75 19.78,70.19 J1.7 ; CN3.3 5.73,66.01 5.73,57.46 7.33,55.87 16.83,55.87 ; 17.18,55.85 17.17,55.87 16.84,55.87 ; 17.18,55.85 17.18,55.51 ; 17.18,55.85 17.18,56.21 ; 17.18,56.21 16.84,55.87 ; 17.18,56.21 17.18,70.19 ; 16.84,55.87 16.83,55.87 ; 16.83,55.87 17.18,55.51 ; 17.18,53.99 17.18,55.51
AOL: length 59
  Top Layer w0.381: 17.19,12.7 17.19,12.27 ; 17.19,12.7 16.78,12.7 ; 17.19,12.7 17.19,13.11 ; 17.19,12.27 16.75,12.7 ; 17.19,12.27 J4.6 35.62,8.59 M3.12 37.76,6.45 37.76,5.03 38.85,3.94 M4.1 ; 11.71,13.06 12.07,12.7 ; 11.71,13.06 11.35,12.7 ; 11.71,13.06 CN4.5 ; 11.71,13.06 11.71,12.7 11.7,12.7 ; 12.07,12.7 11.7,12.7 ; 12.07,12.7 16.75,12.7 ; 16.78,12.7 17.19,13.11 ; 16.78,12.7 16.75,12.7 ; 17.19,13.11 J4.7 ; 11.35,12.7 CN4.4 ; 11.35,12.7 11.7,12.7
AOR: length 75.3
  Top Layer w0.381: J3.6 19.37,28.91 21.22,27.05 21.22,18.36 28.54,11.05 36.51,11.05 38.55,9.02 41.57,9.02 42.81,7.77 42.81,6.48 ; J3.6 J3.7 ; J3.6 14.9,28.91 14.09,28.09 14.09,24.05 12.94,22.91 8.09,22.91 7.33,22.15 7.33,20.62 7,20.3 CN4.3
GPIO1: length 110.3
  Top Layer w0.254: M1.9 76.47,52.07 75.2,50.8 75.2,45.72 62.5,33.02 FPC1.21
  Bottom Layer w0.254: H1.5 33.41,60.96 34.69,62.23 75.2,62.23 76.47,63.5 M1.9
GPIO2: length 102.2
  Top Layer w0.254: FPC1.20 62,35.06 72.66,45.72 72.66,50.8 73.93,52.07 v1(73.93,61.34) M1.10
  Bottom Layer w0.254: v1(73.93,61.34) 37.48,61.34 37.1,60.96 H1.6
GPIO3: length 102
  Top Layer w0.254: M1.11 v1(71.39,60.45) 71.39,52.07 70.12,50.8 70.12,45.72 61.5,37.1 FPC1.19
  Bottom Layer w0.254: H1.7 34.56,59.69 37.1,59.69 37.86,60.45 v1(71.39,60.45)
GPIO4: length 95.7
  Top Layer w0.254: FPC1.18 61,39.14 67.58,45.72 67.58,50.67 68.85,51.94 v1(68.85,59.56) M1.12
  Bottom Layer w0.254: v1(68.85,59.56) 38.23,59.56 37.1,58.42 H1.8
GPIO5: length 93
  Top Layer w0.254: M1.14 v1(63.77,58.67) 65.04,57.4 65.04,45.72 60.5,41.18 FPC1.17
  Bottom Layer w0.254: v1(63.77,58.67) 38.62,58.67 37.1,57.15 34.56,57.15 H1.9
GPIO6: length 86.7
  Top Layer w0.254: FPC1.16 60,43.22 62.5,45.72 62.5,56.52 v1(61.23,57.78) M1.15
  Bottom Layer w0.254: v1(61.23,57.78) 39,57.78 37.1,55.88 H1.10
GPIO7: length 86.6
  Top Layer w0.254: M1.16 v1(58.69,56.9) 59.96,55.63 59.96,45.72 59.5,45.26 FPC1.15
  Bottom Layer w0.254: v1(58.69,56.9) 39.38,56.9 37.1,54.61 34.56,54.61 H1.11
GPIO8: length 81.6
  Top Layer w0.254: FPC1.14 59,44.14 57.42,45.72 57.42,54.74 v1(56.15,56.01) M1.17
  Bottom Layer w0.254: v1(56.15,56.01) 39.77,56.01 37.1,53.34 H1.12
GPIO9: length 81.6
  Top Layer w0.254: M1.19 v1(51.07,55.12) 54.88,51.31 54.88,45.72 58.5,42.1 FPC1.13
  Bottom Layer w0.254: v1(51.07,55.12) 40.15,55.12 37.1,52.07 34.56,52.07 H1.13
GPIO10: length 77
  Top Layer w0.254: M1.20 v1(48.53,54.23) 52.34,50.42 52.34,45.72 58,40.06 FPC1.12
  Bottom Layer w0.254: H1.14 37.1,50.8 40.53,54.23 v1(48.53,54.23)
GPIO11: length 106.1
  Top Layer w0.254: FPC1.11 57.5,34.21 45.99,45.72 v1(45.99,53.34)
  Bottom Layer w0.254: H1.15 33.41,48.26 34.69,49.53 37.1,49.53 40.91,53.34 v1(45.99,53.34) 76.47,53.34 81.55,48.26 M1.34
GPIO12: length 97
  Top Layer w0.254: FPC1.10 57,33.82 45.1,45.72 v1(45.1,52.45)
  Bottom Layer w0.254: H1.16 37.1,48.26 41.29,52.45 72.28,52.45 76.47,48.26 M1.32
GPIO13: length 96.6
  Top Layer w0.254: FPC1.9 56.5,33.43 44.21,45.72 v1(44.21,51.56)
  Bottom Layer w0.254: M1.31 73.93,48.26 70.63,51.56 41.67,51.56 37.1,46.99 34.56,46.99 H1.17
GPIO14: length 87.5
  Top Layer w0.254: FPC1.8 56,33.04 43.32,45.72 v1(43.32,50.67)
  Bottom Layer w0.254: M1.29 68.85,48.26 66.44,50.67 42.05,50.67 37.1,45.72 H1.18
GPIO15: length 84.5
  Top Layer w0.254: FPC1.7 55.5,32.65 42.43,45.72 v1(42.43,49.78)
  Bottom Layer w0.254: M1.27 63.77,48.26 62.24,49.78 v1(42.43,49.78) 37.1,44.45 34.56,44.45 H1.19
I2S_BCK: length 90.9
  Top Layer w0.254: v1(52.34,73.66) 52.34,57.02 56.15,53.21 M1.24
  Bottom Layer w0.254: M3.7 37.73,27.94 37.35,28.32 37.35,33.53 41.92,38.1 51.07,38.1 56.15,43.18 M1.24 ; v1(52.34,73.66) 52.34,76.64 37.1,91.88 37.1,96.52
I2S_LRCK: length 96.6
  Top Layer w0.254: v1(57.42,73.66) 57.42,56.52 58.69,55.25 M1.25 ; v1(38.62,32.64) 32.91,32.64 32.27,32 32.27,30.86
  Bottom Layer w0.254: 32.27,30.86 32.27,28.32 32.65,27.94 32.65,26.8 ; 42.18,96.52 42.18,90.97 57.42,75.73 v1(57.42,73.66) ; v1(38.62,32.64) 42.56,36.58 52.08,36.58 58.69,43.18 M1.25
I2S_SCK: length 91.4
  Top Layer w0.254: M1.26 61.23,56.01 59.96,57.28 v1(59.96,73.66)
  Bottom Layer w0.254: M1.26 61.23,43.18 53.1,35.05 43.19,35.05 39.89,31.75 39.89,28.32 40.27,27.94 40.27,26.8 ; v1(59.96,73.66) 59.96,77.22 44.72,92.46 44.72,96.52
I2S_SDIN: length 54.3
  Top Layer w0.254: M1.22 51.07,48.89 47.26,52.7 47.26,60.96 40.91,67.31 40.91,86.36 39.64,87.63 39.64,96.52
I2S_SDOUT: length 28.2
  Bottom Layer w0.254: M3.8 35.19,27.94 34.81,28.32 34.81,33.15 41.29,39.62 44.97,39.62 48.53,43.18 M1.21
MIDI_RX: length 77.8
  Top Layer w0.254: M1.2 94.25,55.88 92.98,54.61 92.98,34.8 88.63,30.46 68.82,30.46 67.32,28.96 67.32,22.1 65.67,20.45 R2.1
  Top Layer w0.381: R2.1 U1.6
MIDI_TX: length 34.4
  Top Layer w0.254: M1.1 96.79,66.04 94.25,68.58 84.47,68.58 75.2,77.85 75.2,81.79 76.01,82.6 U2.2
PSRAM_CE: length 32.8
  Top Layer w0.381: 82.23,37.47 R5.1
  Bottom Layer w0.254: v1(82.23,36.03) 82.23,37.39 82.82,37.97 82.82,52.07 81.55,53.34 M1.7
SPI0_RX: length 28.7
  Top Layer w0.254: v1(85.36,50.8) 85.36,40.39 83.71,38.74 U3.2
  Bottom Layer w0.254: v1(85.36,50.8) 85.36,52.07 84.09,53.34 M1.6
SPI0_SCK: length 31.7
  Top Layer w0.254: M1.4 89.17,59.69 80.28,50.8 80.28,43.18 77.1,40.01 U3.6
SPI0_TX: length 29.3
  Top Layer w0.254: M1.5 86.63,59.69 77.74,50.8 77.74,42.04 76.98,41.28 U3.5
$1N8448: length 32.8
  Top Layer w0.381: 78.63,15.62 78.63,22.48 75.07,26.03 R1.1 ; 78.63,15.62 78.63,6.86 81.04,4.44 D1.2 ; 78.63,15.62 78.63,15.62 U1.2
$1N8617: length 4.2
  Top Layer w0.381: U2.4 81.13,81.65 81.51,81.27 81.51,78.65
$1N9304: length 6.2
  Top Layer w0.381: CN1.4 82.82,22.22 81.04,24 R1.2
$1N9313: length 12.4
  Top Layer w0.381: D1.1 82.58,10.35 CN1.2 84.45,16.28 82.56,18.16 U1.3
$1N9335: length 2.9
  Top Layer w0.381: CN2.4 81.51,86.97
$1N9340: length 2.9
  Top Layer w0.381: CN2.2 81.51,76.97
$1N10058: length 23.9
  Top Layer w0.254: 50.43,26.8 49.14,25.5 28.87,25.5 M3.11
$1N10064: length 6.4
  Top Layer w0.254: M4.5 38.62,15.75 38.62,17.53 40.27,19.18
$1N32637: length 3.8
  Top Layer w0.762: NOREF#4.1 M1.37
$1N32663: length 3.8
  Top Layer w0.762: M1.36 NOREF.1

## Copper pours and planes (outline as drawn; the poured copper is in the pictures)
3V3 on Top Layer: 73.81,33.12 76.48,33.12 76.48,31.79 73.81,31.79
3V3 on Top Layer: 53.99,6.32 55.01,6.32 55.01,5.13 53.99,5.13
+5V on Top Layer: 52.47,6.22 53.49,6.22 53.49,5.13 52.47,5.13
GND on Top Layer: 0.29,99.09 0.29,0.03 73.34,0.03 74.87,1.55 74.87,21.62 73.72,22.76 69.53,22.76 68.26,24.03 68.26,28.35 69.28,29.36 98.09,29.36 99.38,30.65 99.38,99.09
GND on Top Layer: 62.99,6.32 64.01,6.32 64.01,5.13 62.99,5.13
GND on Bottom Layer: 0.27,99.09 0.27,0.03 73.32,0.03 74.84,1.55 74.84,21.62 73.7,22.76 69.51,22.76 68.24,24.03 68.24,28.35 69.25,29.36 98.07,29.36 99.35,30.65 99.35,99.09
AIL on Top Layer: 17.2,87.35 17.92,87.35 17.92,85.91 17.2,85.91

## Text on the board
Top Silkscreen Layer: PSRAM | LEFT | RIGHT | AUDIO IN | AUDIO OUT | ADC MODULE | PCM1808 | RASPBERRY | PICO | / | PICO2 | PI | MIDI OUT | MIDI IN | DAC MODULE | PCM5102 | USB
